# Altium project 3DAS_4Camera.PrjPcb (part 4 of 10)

## Sheet [8] RJ45 Connector.SchDoc: ARS Camera REV01 USB and WiFi
size A4; DrawnBy: Manh Ngo Van; Engineer: Manh Ngo Van; Organization: Altium Limited; Address1: L3, 12a Rodborough Rd; Address2: Frenchs Forest; Address3: NSW; Address4: Australia 2086; DocumentNumber: 8; Revision: 1.0; SheetNumber: 8; SheetTotal: 16
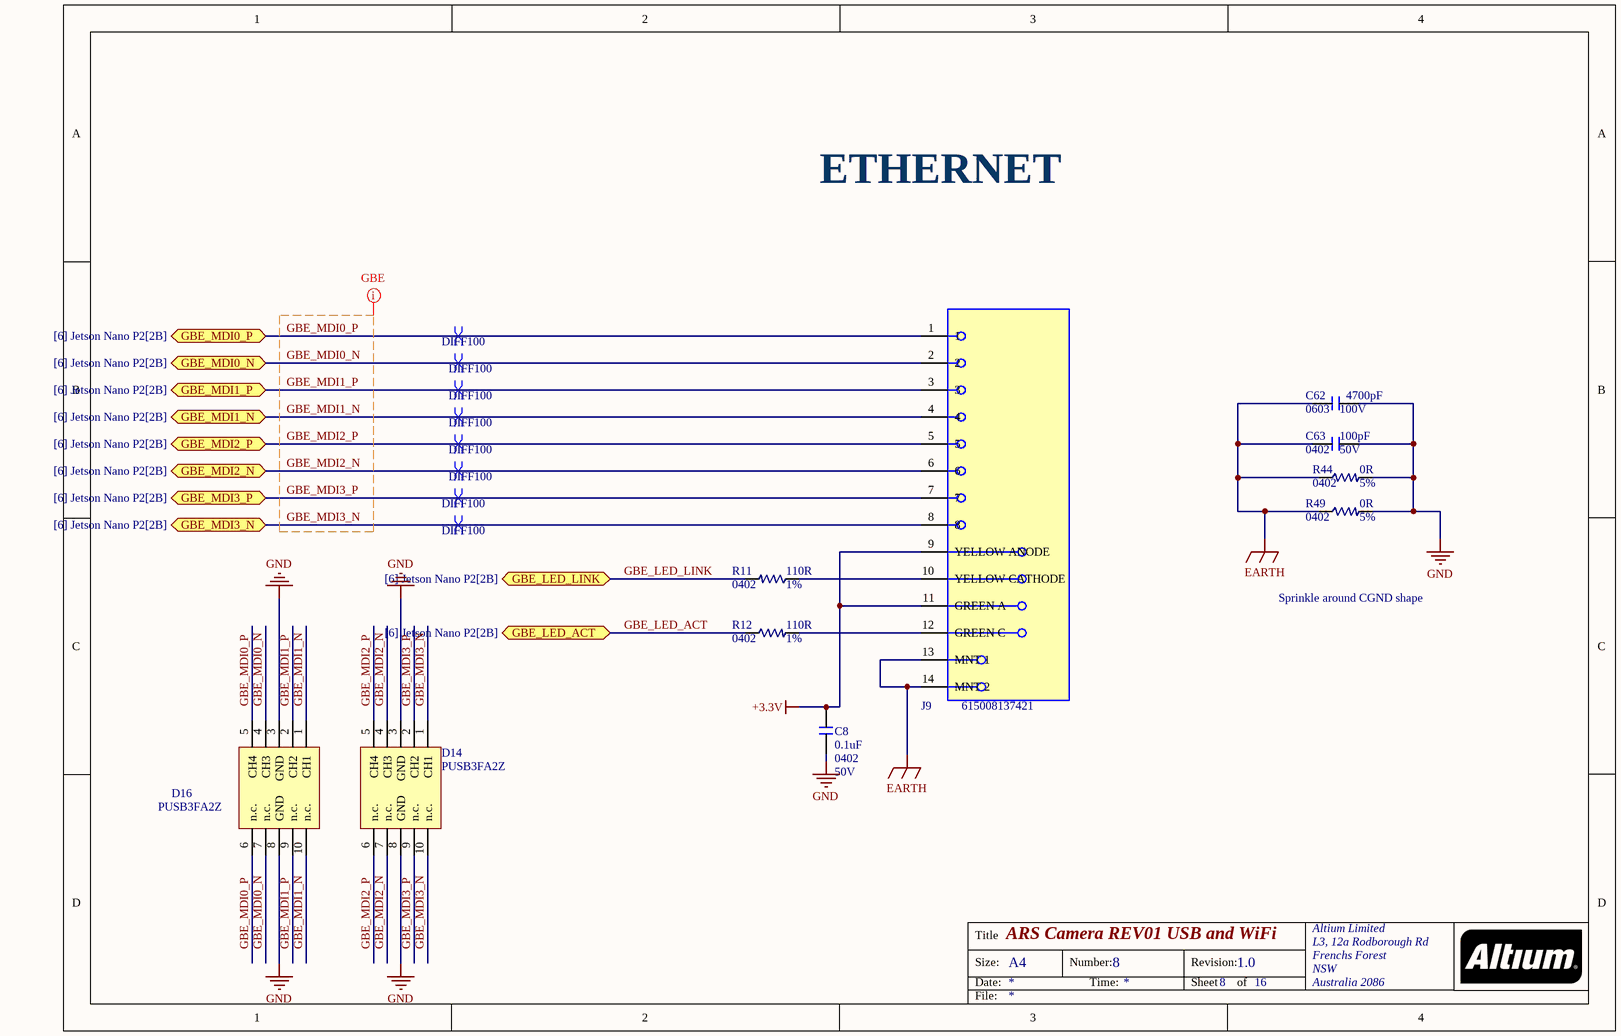
[diagram p7: [8] RJ45 Connector.SchDoc]

### Parts
C8  0.1uF  Case/Package: 0402  Voltage: 50V  [C0402M]
C62  4700pF  Case/Package: 0603  Voltage Rating: 100V  [C0603M]
C63  100pF  Case/Package: 0402  Voltage: 50V  [C0402M]
D14  PUSB3FA2Z  [SON50P100X50-10N]
D16  PUSB3FA2Z  [SON50P100X50-10N]
J9  615008137421  [Wurth_615008137421_MFG]
R11  110R  Case Code (Imperial): 0402  Tolerance: 1%  [R0402M]
R12  110R  Case Code (Imperial): 0402  Tolerance: 1%  [R0402M]
R44  0R  Case/Package: 0402  Resistance Tolerance: 5%  [R0402M]
R49  0R  Case/Package: 0402  Resistance Tolerance: 5%  [R0402M]

### Ports
GBE_LED_ACT (bidir, see [6] Jetson Nano P2[2B]), GBE_LED_LINK (bidir, see [6] Jetson Nano P2[2B]), GBE_MDI0_N (bidir, see [6] Jetson Nano P2[2B]), GBE_MDI0_P (bidir, see [6] Jetson Nano P2[2B]), GBE_MDI1_N (bidir, see [6] Jetson Nano P2[2B]), GBE_MDI1_P (bidir, see [6] Jetson Nano P2[2B]), GBE_MDI2_N (bidir, see [6] Jetson Nano P2[2B]), GBE_MDI2_P (bidir, see [6] Jetson Nano P2[2B]), GBE_MDI3_N (bidir, see [6] Jetson Nano P2[2B]), GBE_MDI3_P (bidir, see [6] Jetson Nano P2[2B])

### Nets
+3.3V: C8.2 J9.9(YELLOW_ANODE) J9.11(GREEN_A)
EARTH: C62.1 C63.2 J9.13(MNT_1) J9.14(MNT_2) R44.2 R49.2
GND: C8.1 C62.2 C63.1 D14.3(GND) D14.8(GND) D16.3(GND) D16.8(GND) R44.1 R49.1
GBE_LED_ACT: R12.2 ; port GBE_LED_ACT
GBE_LED_LINK: R11.1 ; port GBE_LED_LINK
GBE_MDI0_N: D16.4(CH3) D16.7(n.c.) J9.2 ; port GBE_MDI0_N
GBE_MDI0_P: D16.5(CH4) D16.6(n.c.) J9.1 ; port GBE_MDI0_P
GBE_MDI1_N: D16.1(CH1) D16.10(n.c.) J9.4 ; port GBE_MDI1_N
GBE_MDI1_P: D16.2(CH2) D16.9(n.c.) J9.3 ; port GBE_MDI1_P
GBE_MDI2_N: D14.4(CH3) D14.7(n.c.) J9.6 ; port GBE_MDI2_N
GBE_MDI2_P: D14.5(CH4) D14.6(n.c.) J9.5 ; port GBE_MDI2_P
GBE_MDI3_N: D14.1(CH1) D14.10(n.c.) J9.8 ; port GBE_MDI3_N
GBE_MDI3_P: D14.2(CH2) D14.9(n.c.) J9.7 ; port GBE_MDI3_P
NetJ9_10: J9.10(YELLOW_CATHODE) R11.2
NetJ9_12: J9.12(GREEN_C) R12.1

### Layout directives
differential pair; differential pair class DIFF100; net class DIFF100: GBE_MDI0_N, GBE_MDI0_P, GBE_MDI1_N, GBE_MDI1_P, GBE_MDI2_N, GBE_MDI2_P, GBE_MDI3_N, GBE_MDI3_P
net class GBE; rule Matched Net Lengths [Tolerance = 20mil]: GBE_MDI0_N, GBE_MDI0_P, GBE_MDI1_N, GBE_MDI1_P, GBE_MDI2_N, GBE_MDI2_P, GBE_MDI3_N, GBE_MDI3_P

### Notes on the sheet
- ETHERNET
- Sprinkle around CGND shape
- Title
- Size:
- Date:
- A4
- Number:
- Time:
- Revision:
- Sheet
- of
- File:

### Library data of the parts
C8 = CAP_CER: CAP CER 0.1UF 50V X7R 0402; Manufacturer: Murata; Manufacturer Part Number: GRM155R71H104KE14D; Material: Ceramic; Tolerance: 10%; Capacitance: 100nF; Dissipation Factor: 0.025%; ComponentLink1URL: https://datasheet.ciiva.com/25741/cl10b104kb8nnnl-25741341.pdf?src-supplier=Digi-Key; ComponentLink1Description: https://datasheet.ciiva.com/25741/cl10b104kb8nnnl-25741341.pdf?src-supplier=Digi-Key; ComponentLink2URL: https://datasheet.ciiva.com/26838/getdatasheetpartid-357523-26838415.pdf?src-supplier=Verical; ComponentLink2Description: https://datasheet.ciiva.com/26838/getdatasheetpartid-357523-26838415.pdf?src-supplier=Verical; Supplier 1: Digi-Key; Supplier Part Number 1: 490-10700-1-ND; Stock 1: 2282266; Pricing 1: 1 = 0.10000, 10 = 0.04600, 100 = 0.02050, 500 = 0.01464, 1000 = 0.01150, 2500 = 0.01045, 5000 = 0.00961 (USD); RoHS: Yes; Mount: Surface Mount; Weight: 0.000212oz; Case Code (Metric): 1005; Case Code (Imperial): 0402; Dielectric Material: Ceramic; Min Operating Temperature: -55°C; Max Operating Temperature: 125°C; Packaging: Tape and Reel; Dielectric: X7R; Voltage Rating: 50V; Termination: SMD/SMT; Composition: Ceramic; Voltage Rating (DC): 50V; Package Quantity: 10000; Length: 1mm; Height: 0.5mm; Width: 0.5mm; Thickness: 0.022inch; Depth: 0.5mm; REACH SVHC: No SVHC; Lead Free: Lead Free; ComponentLink3URL: http://www.farnell.com/datasheets/2079156.pdf?src-supplier=Farnell; ComponentLink3Description: http://www.farnell.com/datasheets/2079156.pdf?src-supplier=Farnell; ComponentLink4URL: http://www.mouser.com/ds/2/281/c02e-2905.pdf?src-supplier=Mouser; ComponentLink4Description: http://www.mouser.com/ds/2/281/c02e-2905.pdf?src-supplier=Mouser; ComponentLink5URL: http://components.arrow.com/part/dataview/0323_07030614?src-supplier=Arrow+Europe; ComponentLink5Description: http://components.arrow.com/part/dataview/0323_07030614?src-supplier=Arrow+Europe; ComponentLink6URL: https://search.murata.co.jp/Ceramy/image/img/A01X/G101/ENG/GRM155R71H104KE14-01.pdf?src-supplier=Digi-Key; ComponentLink6Description: https://search.murata.co.jp/Ceramy/image/img/A01X/G101/ENG/GRM155R71H104KE14-01.pdf?src-supplier=Digi-Key; ComponentLink7URL: http://psearch.en.murata.com/capacitor/product/GRM155R71H104KE14%23.pdf?src-supplier=Avnet; ComponentLink7Description: http://psearch.en.murata.com/capacitor/product/GRM155R71H104KE14%23.pdf?src-supplier=Avnet; ComponentLink8URL: http://www.farnell.com/datasheets/2079156.pdf?src-supplier=Element14; ComponentLink8Description: http://www.farnell.com/datasheets/2079156.pdf?src-supplier=Element14; ComponentLink9URL: http://www.farnell.com/datasheets/2079156.pdf?src-supplier=Newark; ComponentLink9Description: http://www.farnell.com/datasheets/2079156.pdf?src-supplier=Newark
C62 = CAP_CER: CAP CER 4700PF 100V X7R 0603; Manufacturer 1: TDK; Manufacturer Part Number 1: CGA3E2X7R2A472K080AA; Mouting Technology: SMT; Capacitance: 4.7nF; Tolerance: 10%; Pin: 2; Supplier 1: Digi-Key; Supplier Part Number 1: 445-5810-1-ND; RoHS: Yes; Category: Ceramic Capacitors; Stock 1: 81816; Pricing 1: 1=0.10000, 10=0.06700, 50=0.03640, 100=0.02960, 500=0.02118, 1000=0.01664 (USD); Mount: Surface Mount; Case Code (Metric): 1608; Case Code (Imperial): 0603; Weight: 7.1E-05oz; Min Operating Temperature: -55°C; Max Operating Temperature: 125°C; Packaging: Tape and Reel; Voltage Rating (DC): 100V; Dielectric: X7R; Termination: SMD/SMT; Series: CGA; Package Quantity: 1; Resistor Type: Ceramic; Length: 1.6mm; Width: 0.031inch; Height: 0.8mm; Depth: 0.8mm; Thickness: 0.035inch; Ratings: AEC-Q200; RoHS Compliant: Yes; REACH SVHC: No SVHC; ComponentLink1URL: https://datasheet.ciiva.com/24218/cga3e2x7r2a472k080aa-266293-24218782.pdf?src-supplier=Mouser; ComponentLink1Description: https://datasheet.ciiva.com/24218/cga3e2x7r2a472k080aa-266293-24218782.pdf?src-supplier=Mouser; ComponentLink2URL: https://datasheet.ciiva.com/7975/1807242-7975353.pdf?src-supplier=Element14; ComponentLink2Description: https://datasheet.ciiva.com/7975/1807242-7975353.pdf?src-supplier=Element14
C63 = CAP_CER: CAP CER 100PF 50V C0G/NP0 0402; Manufacturer: Murata; Manufacturer Part Number: GRM1555C1H101JA01J; Tolerance: 5%; Dielectric: C0G; ComponentLink1URL: https://datasheet.ciiva.com/11786/0900766b80ef921d-11786069.pdf?src-supplier=RSComponents; ComponentLink1Description: https://datasheet.ciiva.com/11786/0900766b80ef921d-11786069.pdf?src-supplier=RSComponents; ComponentLink2URL: https://datasheet.ciiva.com/18184/getdatasheetpartid-199957-18184175.pdf?src-supplier=Verical; ComponentLink2Description: https://datasheet.ciiva.com/18184/getdatasheetpartid-199957-18184175.pdf?src-supplier=Verical; ComponentLink3URL: https://datasheet.ciiva.com/29200/453557-da-01-en-vs-kondensator-0402-29200111.pdf?src-supplier=Conrad; ComponentLink3Description: https://datasheet.ciiva.com/29200/453557-da-01-en-vs-kondensator-0402-29200111.pdf?src-supplier=Conrad; ComponentLink4URL: https://datasheet.ciiva.com/16440/product-16440566.pdf?src-supplier=Future+Electronics; ComponentLink4Description: https://datasheet.ciiva.com/16440/product-16440566.pdf?src-supplier=Future+Electronics; ComponentLink5URL: https://datasheet.ciiva.com/6271/partnumbering-e-01-6271071.pdf?src-supplier=Digi-Key; ComponentLink5Description: https://datasheet.ciiva.com/6271/partnumbering-e-01-6271071.pdf?src-supplier=Digi-Key; ComponentLink6URL: https://datasheet.ciiva.com/29541/partnumbering-e-01-29541637.pdf?src-supplier=Digi-Key; ComponentLink6Description: https://datasheet.ciiva.com/29541/partnumbering-e-01-29541637.pdf?src-supplier=Digi-Key; Supplier 1: Digi-Key; Supplier Part Number 1: 490-7754-1-ND; Stock 1: 869107; Pricing 1: 1 = 0.10000, 10 = 0.03700, 50 = 0.02040, 100 = 0.01660, 500 = 0.01186, 1000 = 0.00932, 2500 = 0.00847, 5000 = 0.00779 (USD); RoHS: Yes; Mount: Surface Mount; Case Code (Imperial): 0402; Case Code (Metric): 1005; Min Operating Temperature: -55°C; Max Operating Temperature: 125°C; Voltage Rating: 50V; Capacitance: 100pF; Voltage Rating (DC): 50V; Packaging: Tape and Reel; Package Quantity: 50000; Termination: SMD/SMT; Length: 1mm; Height: 0.5mm; Width: 0.5mm; Thickness: 0.022inch; Depth: 0.5mm; Radiation Hardening: No; Lead Free: Lead Free; ComponentLink7URL: https://datasheet.ciiva.com/5437/product-5437730.pdf?src-supplier=Mouser; ComponentLink7Description: https://datasheet.ciiva.com/5437/product-5437730.pdf?src-supplier=Mouser; ComponentLink8URL: https://datasheet.ciiva.com/29534/partnumbering-e-01-29534039.pdf?src-supplier=Digi-Key; ComponentLink8Description: https://datasheet.ciiva.com/29534/partnumbering-e-01-29534039.pdf?src-supplier=Digi-Key; ComponentLink9URL: https://datasheet.ciiva.com/11605/product-11605752.pdf?src-supplier=Avnet; ComponentLink9Description: https://datasheet.ciiva.com/11605/product-11605752.pdf?src-supplier=Avnet; ComponentLink10URL: https://datasheet.ciiva.com/29534/partnumbering-e-01-29534040.pdf?src-supplier=Digi-Key; ComponentLink10Description: https://datasheet.ciiva.com/29534/partnumbering-e-01-29534040.pdf?src-supplier=Digi-Key; ComponentLink11URL: https://datasheet.ciiva.com/29534/partnumbering-e-01-29534041.pdf?src-supplier=Digi-Key; ComponentLink11Description: https://datasheet.ciiva.com/29534/partnumbering-e-01-29534041.pdf?src-supplier=Digi-Key
D14 D16 = PUSB3FA2Z: ESD Suppressors / TVS Diodes PUSB3FA2 XSON10; Manufacturer 1: Nexperia; Supplier 1: Digi-Key; Manufacturer Part Number 1: PUSB3FA2Z; RoHS: No; Stock 1: 355; Pricing 1: 1=0.33000, 10=0.25600, 100=0.15390, 500=0.14250, 1000=0.09690, 2000=0.08921 (USD); ComponentLink1URL: https://assets.nexperia.com/documents/data-sheet/PUSB3FA2.pdf?src-supplier=Digi-Key; ComponentLink1Description: https://assets.nexperia.com/documents/data-sheet/PUSB3FA2.pdf?src-supplier=Digi-Key; Supplier Part Number 1: 1727-7813-1-ND
J9 = 615008137421: Modular Jack WR-MJ, Tab Up, Shielded, with LED and EMI Panel Finger, Horizontal Entry, THT, 8P8C; Manufacturer 1: Wurth Electronics; Connector Type: Jack,RJ45; Number of Positions: 8; Number of Ports: 1; Current Rating: 1.5A; Mating Cycles: 500; Gender: Female; Voltage Rating (AC): 120V; Insulation Resistance: 500MR; Supplier 1: RSComponents; Supplier Part Number 1: 7350298; Manufacturer Part Number 1: 615008137421; Stock 1: 919; Pricing 1: 1=2.93900, 15=2.64400, 50=2.44300, 250=2.13400 (USD); RoHS: Yes; Mount: Through Hole,PCB; Contact Plating: Gold,Tin; Contact Material: Copper Alloy; Housing Material: PBT; Color: Black,Green,Yellow; Min Operating Temperature: -40°C; Max Operating Temperature: 85°C; Shielding: Shielded; Packaging: Tray; Package Quantity: 60; Number of Rows: 1; Termination: Through Hole; Direction: Up; Number of Contacts: 8; Orientation: Right Angle; Series: WR-MJ; Length: 13.46mm; Width: 16.25mm; Height: 16.93mm; Depth: 15.75mm; RoHS Compliant: Yes; REACH SVHC: Unknown; Flammability Rating: UL94 V-0; ComponentLink1URL: https://datasheet.ciiva.com/6913/76606-6913951.pdf?src-supplier=Newark; ComponentLink1Description: https://datasheet.ciiva.com/6913/76606-6913951.pdf?src-supplier=Newark; ComponentLink2URL: https://datasheet.ciiva.com/4561/615008137421-71402-4561624.pdf?src-supplier=Mouser; ComponentLink2Description: https://datasheet.ciiva.com/4561/615008137421-71402-4561624.pdf?src-supplier=Mouser; ComponentLink3URL: https://datasheet.ciiva.com/686/615008137421-686729.pdf?src-supplier=Digi-Key; ComponentLink3Description: https://datasheet.ciiva.com/686/615008137421-686729.pdf?src-supplier=Digi-Key; ComponentLink4URL: https://datasheet.ciiva.com/11726/0900766b80f88673-11726176.pdf?src-supplier=RSComponents; ComponentLink4Description: https://datasheet.ciiva.com/11726/0900766b80f88673-11726176.pdf?src-supplier=RSComponents; ComponentLink5URL: https://datasheet.ciiva.com/48689/001088215-da-01-en-wr-com-modular-jack-615008137421-48689541.pdf?src-supplier=Conrad; ComponentLink5Description: https://datasheet.ciiva.com/48689/001088215-da-01-en-wr-com-modular-jack-615008137421-48689541.pdf?src-supplier=Conrad
R11 R12 = RES_SMD: RES SMD 110 OHM 1% 1/16W 0402; Manufacturer 1: Yageo; Manufacturer Part Number 1: RC0402FR-07110RL; Mouting Technology: SMT; Power Rating: 63mW; Voltage Rating: 50V; Temperature Coefficient: 100ppm/°C; Pin: 2; Supplier 1: Digi-Key; Supplier Part Number 1: 311-110LRCT-ND; RoHS: Yes; Category: Chip SMD Resistors; Stock 1: 182858; Pricing 1: 1=0.10000, 10=0.01600, 100=0.00660, 1000=0.00299, 2500=0.00259, 5000=0.00214 (USD); Case/Package: 0402; Number of Pins: 2; Case Code (Metric): 1005; Weight: 2.3E-05oz; Size Code: 0402; Min Operating Temperature: -55°C; Max Operating Temperature: 155°C; Resistance: 110R; Packaging: Tape and Reel; Resistor Type: Thick Film; Termination: SMD/SMT; Voltage Rating (DC): 50V; Features: Moisture Resistant; Series: RC; Max Power Dissipation: 63mW; Number of Terminations: 2; Resistance Tolerance: 1%; Construction: Rectangular; Length: 1mm; Width: 0.5mm; Height: 0.35mm; Depth: 0.5mm; REACH SVHC: No SVHC; Military Standard: Not; Lead Free: Lead Free; RoHS Compliant: Yes; ComponentLink1URL: https://datasheet.ciiva.com/12577/pyu-rc0402-51-rohs-l-6-r-12577287.pdf?src-supplier=Mouser; ComponentLink1Description: https://datasheet.ciiva.com/12577/pyu-rc0402-51-rohs-l-6-r-12577287.pdf?src-supplier=Mouser; ComponentLink2URL: https://datasheet.ciiva.com/17070/pyu-rc0402-51-rohs-l-6-r-17070361.pdf?src-supplier=Future+Electronics; ComponentLink2Description: https://datasheet.ciiva.com/17070/pyu-rc0402-51-rohs-l-6-r-17070361.pdf?src-supplier=Future+Electronics; ComponentLink3URL: https://datasheet.ciiva.com/15189/getdatasheetpartid-325087-15189341.pdf?src-supplier=Verical; ComponentLink3Description: https://datasheet.ciiva.com/15189/getdatasheetpartid-325087-15189341.pdf?src-supplier=Verical; ComponentLink4URL: https://datasheet.ciiva.com/7849/1018594-7849822.pdf?src-supplier=Element14; ComponentLink4Description: https://datasheet.ciiva.com/7849/1018594-7849822.pdf?src-supplier=Element14; ComponentLink5URL: https://datasheet.ciiva.com/7849/1018594-7849823.pdf?src-supplier=Element14; ComponentLink5Description: https://datasheet.ciiva.com/7849/1018594-7849823.pdf?src-supplier=Element14
R44 R49 = RES_SMD: YAGEO - RC0402JR-070RL. - RES, THICK FILM, 0R, 0.0625W, 0402; Mouting Technology: SMT; Resistance: 0mR; Power Rating: 62.5mW; Max Power Dissipation: 63mW; Voltage Rating: 50V; Temperature Coefficient: 200ppm/°C; Pin: 2; Supplier 1: RSComponents; Supplier Part Number 1: 6185804; Manufacturer 1: Yageo; Manufacturer Part Number 1: RC0402JR-070RL; Stock 1: 3830000; Pricing 1: 10000=0.00100, 10000=0.00100 (USD); RoHS: Yes; Contact Plating: Tin,Matte; Case Code (Metric): 1005; Case Code (Imperial): 0402; Size Code: 0402; Min Operating Temperature: -55°C; Max Operating Temperature: 155°C; Resistor Type: Thick Film; Packaging: Tape and Reel; Tolerance: 5%; Number of Terminations: 2; Features: Moisture Resistant; Termination: SMD/SMT; Series: RC; Package Quantity: 1; Technology: THICK FILM; Construction: Rectangular; Length: 1mm; Width: 0.02inch; Height: 0.016inch; Depth: 0.5mm; Radiation Hardening: No; RoHS Compliant: Yes; Lead Free: Lead Free; REACH SVHC: Unknown; Military Standard: Not

## Sheet [9] USB 2.0 .SchDoc: ARS Camera REV01 USB and WiFi
size A4; DrawnBy: Manh Ngo Van; Engineer: Manh Ngo Van; Organization: Altium Limited; Address1: L3, 12a Rodborough Rd; Address2: Frenchs Forest; Address3: NSW; Address4: Australia 2086; DocumentNumber: 9; Revision: 1.0; SheetNumber: 9; SheetTotal: 16
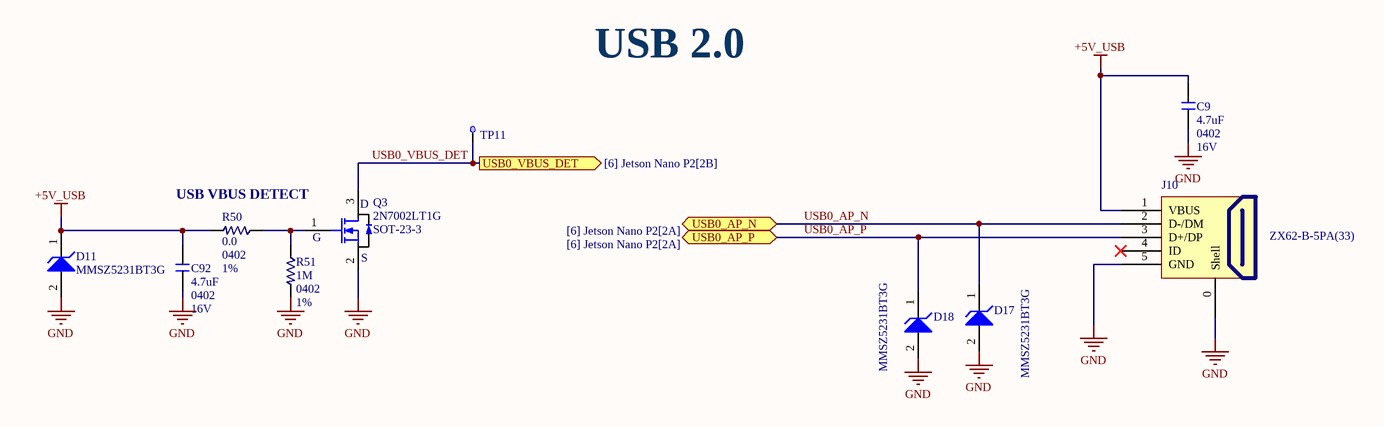
[diagram p8: [9] USB 2.0 .SchDoc]

### Parts
C9  4.7uF  Case/Package: 0402  Voltage Rating: 16V  [C0402M]
C92  4.7uF  Case/Package: 0402  Voltage Rating: 16V  [C0402M]
D11  MMSZ5231BT3G  [SODFL371X135-2N]
D17  MMSZ5231BT3G  [SODFL371X135-2N]
D18  MMSZ5231BT3G  [SODFL371X135-2N]
J10  ZX62-B-5PA(33)  [MICRO-USB-SMD_5P-P0.65-H-M_MICRO-USB-5P]
Q3  2N7002LT1G  Case/Package: SOT-23-3  [SOT95P245X110-3N]
R50  0.0  Case Code (Imperial): 0402  Tolerance: 1%  [R0402M]
R51  1M  Case Code (Imperial): 0402  Tolerance: 1%  [R0402M]
TP11  TP  [Test point]  (value not drawn)  (net tie, no BOM)

### Ports
USB0_AP_N (bidir, see [6] Jetson Nano P2[2A]), USB0_AP_P (bidir, see [6] Jetson Nano P2[2A]), USB0_VBUS_DET (out, see [6] Jetson Nano P2[2B])

### Nets
+5V_USB: C9.1 C92.1 D11.1(K) J10.1(VBUS) R50.1
GND: C9.2 C92.2 D11.2(A) D17.2(A) D18.2(A) J10.0(Shell) J10.5(GND) Q3.2(S) R51.1
USB0_AP_N: D17.1(K) J10.2(D-/DM) ; port USB0_AP_N
USB0_AP_P: D18.1(K) J10.3(D+/DP) ; port USB0_AP_P
USB0_VBUS_DET: Q3.3(D) TP11.1(TP) ; port USB0_VBUS_DET
NetQ3_1: Q3.1(G) R50.2 R51.2

Not connected (* = marked no-connect by the designer): J10 4(ID)*

### Notes on the sheet
- USB 2.0
- (near R50) USB VBUS DETECT
- Title
- Size:
- Date:
- A4
- Number:
- Time:
- Revision:
- Sheet
- of
- File:

### Library data of the parts
C9 C92 = CAP_CER: CAP CER 4.7UF 16V X5R 0402; Manufacturer: Samsung; Manufacturer Part Number: CL05A475MO5NUNC; Tolerance: 20%; ComponentLink1URL: https://datasheet.ciiva.com/25786/cl05a475mp5nrnc-25786963.pdf?src-supplier=Digi-Key; ComponentLink1Description: https://datasheet.ciiva.com/25786/cl05a475mp5nrnc-25786963.pdf?src-supplier=Digi-Key; ComponentLink2URL: https://datasheet.ciiva.com/16437/cl05b104kq5nnnc-16437353.pdf?src-supplier=Future+Electronics; ComponentLink2Description: https://datasheet.ciiva.com/16437/cl05b104kq5nnnc-16437353.pdf?src-supplier=Future+Electronics; Supplier 1: Digi-Key; Supplier Part Number 1: 1276-6836-6-ND; Stock 1: 1677309; Pricing 1: 1 = 0.45000, 10 = 0.32100, 100 = 0.21130, 500 = 0.15656, 1000 = 0.13307, 2500 = 0.12524, 5000 = 0.11741 (USD); RoHS: Yes; Mount: Surface Mount; Case Code (Imperial): 0402; Case Code (Metric): 1005; Min Operating Temperature: -55°C; Max Operating Temperature: 85°C; Packaging: Tape and Reel; Capacitance: 4.7uF; Length: 0.039inch; Width: 0.02inch; Thickness: 0.022inch; ComponentLink3URL: http://www.farnell.com/datasheets/2710653.pdf?src-supplier=Farnell; ComponentLink3Description: http://www.farnell.com/datasheets/2710653.pdf?src-supplier=Farnell; ComponentLink4URL: http://www.farnell.com/datasheets/2710653.pdf?src-supplier=Newark; ComponentLink4Description: http://www.farnell.com/datasheets/2710653.pdf?src-supplier=Newark; ComponentLink5URL: http://www.samsungsem.com/kr/support/product-search/mlcc/CL05A475MO5NUNC.jsp?src-supplier=Digi-Key; ComponentLink5Description: http://www.samsungsem.com/kr/support/product-search/mlcc/CL05A475MO5NUNC.jsp?src-supplier=Digi-Key
D11 D17 D18 = MMSZ5231BT3G: DIODE ZENER 5.1V 500MW SOD123; Manufacturer: ON Semiconductor; Impedance: 17R; Tolerance: 5%; ComponentLink1Description: Manufacturer URL; ComponentLink2Description: Datasheet; ComponentLink3Description: Package Specification; ComponentLink3URL: http://www.onsemi.com/pub_link/Collateral/425-04.PDF; ComponentLink1URL: http://www.onsemi.com/; ComponentLink2URL: http://www.onsemi.com/pub_link/Collateral/MMSZ5221BT1-D.PDF; ComponentLink4URL: https://media.digikey.com/pdf/Data%20Sheets/Ethertronics/M830120.pdf?src-supplier=Digi-Key; ComponentLink4Description: https://media.digikey.com/pdf/Data%20Sheets/Ethertronics/M830120.pdf?src-supplier=Digi-Key; ComponentLink5URL: http://datasheets.avx.com/ethertronics/AVX-E_M830120.pdf?src-supplier=Digi-Key; ComponentLink5Description: http://datasheets.avx.com/ethertronics/AVX-E_M830120.pdf?src-supplier=Digi-Key; Supplier 1: Digi-Key; Supplier Part Number 1: MMSZ5231BT3GOSCT-ND; Manufacturer Part Number: MMSZ5231BT3G; Stock 1: 3780; Pricing 1: 1 = 0.21000, 10 = 0.15000, 100 = 0.08090, 500 = 0.06350, 1000 = 0.04410, 2000 = 0.03653, 5000 = 0.03455 (USD); RoHS: Yes; Case/Package: SOD-123-2; Number of Pins: 2; Min Operating Temperature: -55°C; Max Operating Temperature: 150°C; Packaging: Tape and Reel; Zener Voltage: 5.1V; Max Power Dissipation: 500mW; Lead Free: Lead Free; ComponentLink6URL: http://www.mouser.com/ds/2/308/MMSZ5221BT1-D-85810.pdf?src-supplier=Mouser; ComponentLink6Description: http://www.mouser.com/ds/2/308/MMSZ5221BT1-D-85810.pdf?src-supplier=Mouser; ComponentLink7URL: https://4donline.ihs.com/images/VipMasterIC/IC/ONSM/ONSM-S-A0000726829/ONSM-S-A0000726829-1.pdf?hkey=52A5661711E402568146F3353EA87419&src-supplier=Farnell; ComponentLink7Description: https://4donline.ihs.com/images/VipMasterIC/IC/ONSM/ONSM-S-A0000726829/ONSM-S-A0000726829-1.pdf?hkey=52A5661711E402568146F3353EA87419&src-supplier=Farnell; ComponentLink8URL: http://www.onsemi.com/pub/Collateral/MMSZ5221BT1-D.PDF?src-supplier=Digi-Key; ComponentLink8Description: http://www.onsemi.com/pub/Collateral/MMSZ5221BT1-D.PDF?src-supplier=Digi-Key; ComponentLink9URL: https://4donline.ihs.com/images/VipMasterIC/IC/ONSM/ONSM-S-A0000726829/ONSM-S-A0000726829-1.pdf?hkey=52A5661711E402568146F3353EA87419&src-supplier=Newark; ComponentLink9Description: https://4donline.ihs.com/images/VipMasterIC/IC/ONSM/ONSM-S-A0000726829/ONSM-S-A0000726829-1.pdf?hkey=52A5661711E402568146F3353EA87419&src-supplier=Newark; ComponentLink10URL: http://www.onsemi.com/pub/Collateral/MMSZ5221BT1-D.PDF?src-supplier=Avnet; ComponentLink10Description: http://www.onsemi.com/pub/Collateral/MMSZ5221BT1-D.PDF?src-supplier=Avnet; ComponentLink11URL: http://www.onsemi.com/pub_link/Collateral/MMSZ5221BT1-D.PDF?src-supplier=Digi-Key; ComponentLink11Description: http://www.onsemi.com/pub_link/Collateral/MMSZ5221BT1-D.PDF?src-supplier=Digi-Key
J10 = USB Mini: USB - micro B USB 2.0 Receptacle Connector 5 Position Surface Mount, Right Angle; Manufacturer: Hirose; Number of Contacts: 5; USB Standard: USB 2.0; Current Rating: 1.8A; Mating Cycles: 10000; ComponentLink1URL: https://www.molex.com/pdm_docs/sd/1050170001_sd.pdf; ComponentLink1Description: https://www.molex.com/pdm_docs/sd/1050170001_sd.pdf; Supplier 1: Digi-Key; Supplier Part Number 1: H125270CT-ND; Manufacturer Part Number: ZX62-B-5PA(33); Stock 1: 8359; Pricing 1: 1 = 0.84000, 10 = 0.79200, 25 = 0.71280, 50 = 0.63360, 100 = 0.60720, 250 = 0.55440, 500 = 0.52800, 1000 = 0.43560 (USD); RoHS: Yes; Mount: Surface Mount,Horizontal; Contact Material: Copper Alloy; Contact Plating: Gold; Packaging: Tape and Reel; Connector Type: USB; Gender: Receptacle; Orientation: Right Angle; REACH SVHC: Unknown; Lead Free: Lead Free; ComponentLink2URL: http://www.farnell.com/datasheets/2691174.pdf?src-supplier=Farnell; ComponentLink2Description: http://www.farnell.com/datasheets/2691174.pdf?src-supplier=Farnell; ComponentLink3URL: http://www.farnell.com/datasheets/2691174.pdf?src-supplier=Element14; ComponentLink3Description: http://www.farnell.com/datasheets/2691174.pdf?src-supplier=Element14; ComponentLink4URL: https://www.hirose.com/product/en/download_file/key_name/ZX62-B-5PA%2833%29/category/Specification%20Sheet/doc_file_id/87473/?file_category_id=9&item_id=02420033833&is_series=&src-supplier=Digi-Key; ComponentLink4Description: https://www.hirose.com/product/en/download_file/key_name/ZX62-B-5PA%2833%29/category/Specification%20Sheet/doc_file_id/87473/?file_category_id=9&item_id=02420033833&is_series=&src-supplier=Digi-Key; ComponentLink5URL: http://www.farnell.com/datasheets/2060515.pdf?src-supplier=Element14; ComponentLink5Description: http://www.farnell.com/datasheets/2060515.pdf?src-supplier=Element14; ComponentLink6URL: http://www.farnell.com/datasheets/2691174.pdf?src-supplier=Newark; ComponentLink6Description: http://www.farnell.com/datasheets/2691174.pdf?src-supplier=Newark
Q3 = NMOS: MOSFET N-CH 60V 0.115A SOT-23; Manufacturer: ON Semiconductor; Gate to Source Voltage (Vgs): 20V; Continuous Drain Current (ID): 115mA; Turn-Off Delay Time: 40ns; Turn-On Delay Time: 20ns; Rds On Max: 7.5R; Input Capacitance: 50pF; Nominal Vgs: 2.5V; Number of Elements: 1; Max Power Dissipation: 225mW; Element Configuration: Single; Power Dissipation: 300mW; ComponentLink1URL: https://datasheet.ciiva.com/6371/dmn65d8l-6371124.pdf?src-supplier=Digi-Key; ComponentLink1Description: https://datasheet.ciiva.com/6371/dmn65d8l-6371124.pdf?src-supplier=Digi-Key; ComponentLink2URL: https://datasheet.ciiva.com/13058/dmn65d8l-219098-13058455.pdf?src-supplier=Mouser; ComponentLink2Description: https://datasheet.ciiva.com/13058/dmn65d8l-219098-13058455.pdf?src-supplier=Mouser; ComponentLink3URL: https://datasheet.ciiva.com/6371/dmn65d8l-6371126.pdf?src-supplier=Digi-Key; ComponentLink3Description: https://datasheet.ciiva.com/6371/dmn65d8l-6371126.pdf?src-supplier=Digi-Key; ComponentLink4URL: https://datasheet.ciiva.com/6371/dmn65d8l-6371128.pdf?src-supplier=Digi-Key; ComponentLink4Description: https://datasheet.ciiva.com/6371/dmn65d8l-6371128.pdf?src-supplier=Digi-Key; Supplier 1: Digi-Key; Supplier Part Number 1: 2N7002LT1GOSCT-ND; Manufacturer Part Number: 2N7002LT1G; Stock 1: 616639; Pricing 1: 1 = 0.18000, 10 = 0.16400, 25 = 0.15640, 100 = 0.06880, 250 = 0.06600, 500 = 0.05400, 1000 = 0.03750 (USD); RoHS: Yes; Number of Pins: 3; Contact Plating: Tin,Matte; Min Operating Temperature: -55°C; Max Operating Temperature: 150°C; Package Quantity: 1; On-State Resistance: 7.5R; Packaging: Tape and Reel; Drain to Source Voltage (Vdss): 60V; Drain to Source Breakdown Voltage: 60V; Drain to Source Resistance: 7.5R; Threshold Voltage: 2.5V; Voltage Rating (DC): 60V; Current Rating: 115mA; Number of Channels: 1; Length: 3.04mm; Height: 1.01mm; Width: 1.4mm; Radiation Hardening: No; Lead Free: Lead Free; Halogen Free: Halogen Free; REACH SVHC: No SVHC; ComponentLink5URL: https://datasheet.ciiva.com/936/2n7002l-d-936784.pdf?src-supplier=Digi-Key; ComponentLink5Description: https://datasheet.ciiva.com/936/2n7002l-d-936784.pdf?src-supplier=Digi-Key; ComponentLink6URL: https://datasheet.ciiva.com/22749/1747988-22749570.pdf?src-supplier=Element14; ComponentLink6Description: https://datasheet.ciiva.com/22749/1747988-22749570.pdf?src-supplier=Element14; ComponentLink7URL: https://datasheet.ciiva.com/1188/97418-1188470.pdf?src-supplier=Element14; ComponentLink7Description: https://datasheet.ciiva.com/1188/97418-1188470.pdf?src-supplier=Element14; ComponentLink8URL: https://datasheet.ciiva.com/936/2n7002l-d-936785.pdf?src-supplier=Digi-Key; ComponentLink8Description: https://datasheet.ciiva.com/936/2n7002l-d-936785.pdf?src-supplier=Digi-Key; ComponentLink9URL: https://datasheet.ciiva.com/936/2n7002l-d-936786.pdf?src-supplier=Digi-Key; ComponentLink9Description: https://datasheet.ciiva.com/936/2n7002l-d-936786.pdf?src-supplier=Digi-Key; ComponentLink10URL: https://datasheet.ciiva.com/1254/1747988-1254500.pdf?src-supplier=Newark; ComponentLink10Description: https://datasheet.ciiva.com/1254/1747988-1254500.pdf?src-supplier=Newark; ComponentLink11URL: https://datasheet.ciiva.com/24157/2n7002l-d-24157398.pdf?src-supplier=Future+Electronics; ComponentLink11Description: https://datasheet.ciiva.com/24157/2n7002l-d-24157398.pdf?src-supplier=Future+Electronics; ComponentLink12URL: https://datasheet.ciiva.com/1188/97418-1188471.pdf?src-supplier=Element14; ComponentLink12Description: https://datasheet.ciiva.com/1188/97418-1188471.pdf?src-supplier=Element14; ComponentLink13URL: https://datasheet.ciiva.com/8114/2n7002l-d-8114823.pdf?src-supplier=Avnet; ComponentLink13Description: https://datasheet.ciiva.com/8114/2n7002l-d-8114823.pdf?src-supplier=Avnet; ComponentLink14URL: https://datasheet.ciiva.com/3304/2n7002l-d-3304393.pdf?src-supplier=Avnet; ComponentLink14Description: https://datasheet.ciiva.com/3304/2n7002l-d-3304393.pdf?src-supplier=Avnet; ComponentLink15URL: https://datasheet.ciiva.com/26146/2n7002l-d-26146173.pdf?src-supplier=Avnet+Europe; ComponentLink15Description: https://datasheet.ciiva.com/26146/2n7002l-d-26146173.pdf?src-supplier=Avnet+Europe; ComponentLink16URL: https://datasheet.ciiva.com/16542/2n7002l-d-16542607.pdf?src-supplier=Avnet+Asia; ComponentLink16Description: https://datasheet.ciiva.com/16542/2n7002l-d-16542607.pdf?src-supplier=Avnet+Asia
R50 = RES_SMD: RES SMD 0 OHM JUMPER 1/16W 0402; Manufacturer: Yageo; Manufacturer Part Number: RC0402FR-070RL; Resistance: 0mR; Power Rating: 62.5mW; Voltage Rating: 50V; Temperature Coefficient: 200ppm/°C; Supplier 1: Digi-Key; Supplier Part Number 1: 311-0.0LRCT-ND; Stock 1: 3964331; Pricing 1: 1 = 0.10000, 10 = 0.01200, 25 = 0.00840, 50 = 0.00640, 100 = 0.00470, 250 = 0.00360, 500 = 0.00288, 1000 = 0.00212, 5000 = 0.00152 (USD); RoHS: Yes; Mount: Surface Mount; Case/Package: 0402; Contact Plating: Tin,Matte; Case Code (Metric): 1005; Min Operating Temperature: -55°C; Max Operating Temperature: 155°C; Resistor Type: Thick Film; Packaging: Tape and Reel; Termination: SMD/SMT; Length: 1mm; Width: 0.5mm; Height: 0.35mm; Radiation Hardening: No; Lead Free: Lead Free; ComponentLink1URL: https://datasheet.ciiva.com/8896/pyu-rc0402-51-rohs-l-6-8896149.pdf?src-supplier=Avnet; ComponentLink1Description: https://datasheet.ciiva.com/8896/pyu-rc0402-51-rohs-l-6-8896149.pdf?src-supplier=Avnet; ComponentLink2URL: https://datasheet.ciiva.com/16790/pyu-rc0402-51-rohs-l-6-r-16790444.pdf?src-supplier=Future+Electronics; ComponentLink2Description: https://datasheet.ciiva.com/16790/pyu-rc0402-51-rohs-l-6-r-16790444.pdf?src-supplier=Future+Electronics; ComponentLink3URL: https://datasheet.ciiva.com/28419/pyu-rc0402-51-rohs-l-6-28419661.pdf?src-supplier=Avnet+Europe; ComponentLink3Description: https://datasheet.ciiva.com/28419/pyu-rc0402-51-rohs-l-6-28419661.pdf?src-supplier=Avnet+Europe; ComponentLink4URL: https://datasheet.ciiva.com/16869/pyu-rc0402-51-rohs-l-6-16869518.pdf?src-supplier=Avnet+Europe; ComponentLink4Description: https://datasheet.ciiva.com/16869/pyu-rc0402-51-rohs-l-6-16869518.pdf?src-supplier=Avnet+Europe
R51 = RES_SMD: RES SMD 1M OHM 1% 1/16W 0402; Manufacturer: Yageo; Manufacturer Part Number: RC0402FR-071ML; Resistance: 1MR; Power Rating: 63mW; Voltage Rating: 50V; Temperature Coefficient: 100ppm/°C; Supplier 1: Digi-Key; Supplier Part Number 1: 311-1.00MLRCT-ND; Stock 1: 5211374; Pricing 1: 1 = 0.10000, 10 = 0.01400, 100 = 0.00580, 1000 = 0.00260, 2500 = 0.00226, 5000 = 0.00186 (USD); RoHS: Yes; Case/Package: 0402; Case Code (Metric): 1005; Min Operating Temperature: -55°C; Max Operating Temperature: 155°C; Resistor Type: Thick Film; Packaging: Tape and Reel; Termination: SMD/SMT; Length: 1mm; Height: 0.32mm; Depth: 0.5mm; REACH SVHC: Unknown; Military Standard: Not; Lead Free: Lead Free; ComponentLink1URL: https://datasheet.ciiva.com/11808/0900766b80c66297-11808125.pdf?src-supplier=RSComponents; ComponentLink1Description: https://datasheet.ciiva.com/11808/0900766b80c66297-11808125.pdf?src-supplier=RSComponents; ComponentLink2URL: https://datasheet.ciiva.com/46394/1018594-46394951.pdf?src-supplier=Element14; ComponentLink2Description: https://datasheet.ciiva.com/46394/1018594-46394951.pdf?src-supplier=Element14; ComponentLink3URL: https://datasheet.ciiva.com/16741/pyu-rc0402-51-rohs-l-6-r-16741081.pdf?src-supplier=Future+Electronics; ComponentLink3Description: https://datasheet.ciiva.com/16741/pyu-rc0402-51-rohs-l-6-r-16741081.pdf?src-supplier=Future+Electronics; ComponentLink4URL: https://datasheet.ciiva.com/7849/1018594-7849882.pdf?src-supplier=Element14; ComponentLink4Description: https://datasheet.ciiva.com/7849/1018594-7849882.pdf?src-supplier=Element14; ComponentLink5URL: https://datasheet.ciiva.com/7849/1018594-7849883.pdf?src-supplier=Element14; ComponentLink5Description: https://datasheet.ciiva.com/7849/1018594-7849883.pdf?src-supplier=Element14
TP11 = TestPoint

## Sheet [10] Peripheral.SchDoc: ARS Camera REV01 Peripherals
size A3; DrawnBy: Manh Ngo Van; Engineer: Manh Ngo Van; Organization: Altium Limited; Address1: L3, 12a Rodborough Rd; Address2: Frenchs Forest; Address3: NSW; Address4: Australia 2086; DocumentNumber: 10; Revision: 1.0; SheetNumber: 10; SheetTotal: 16
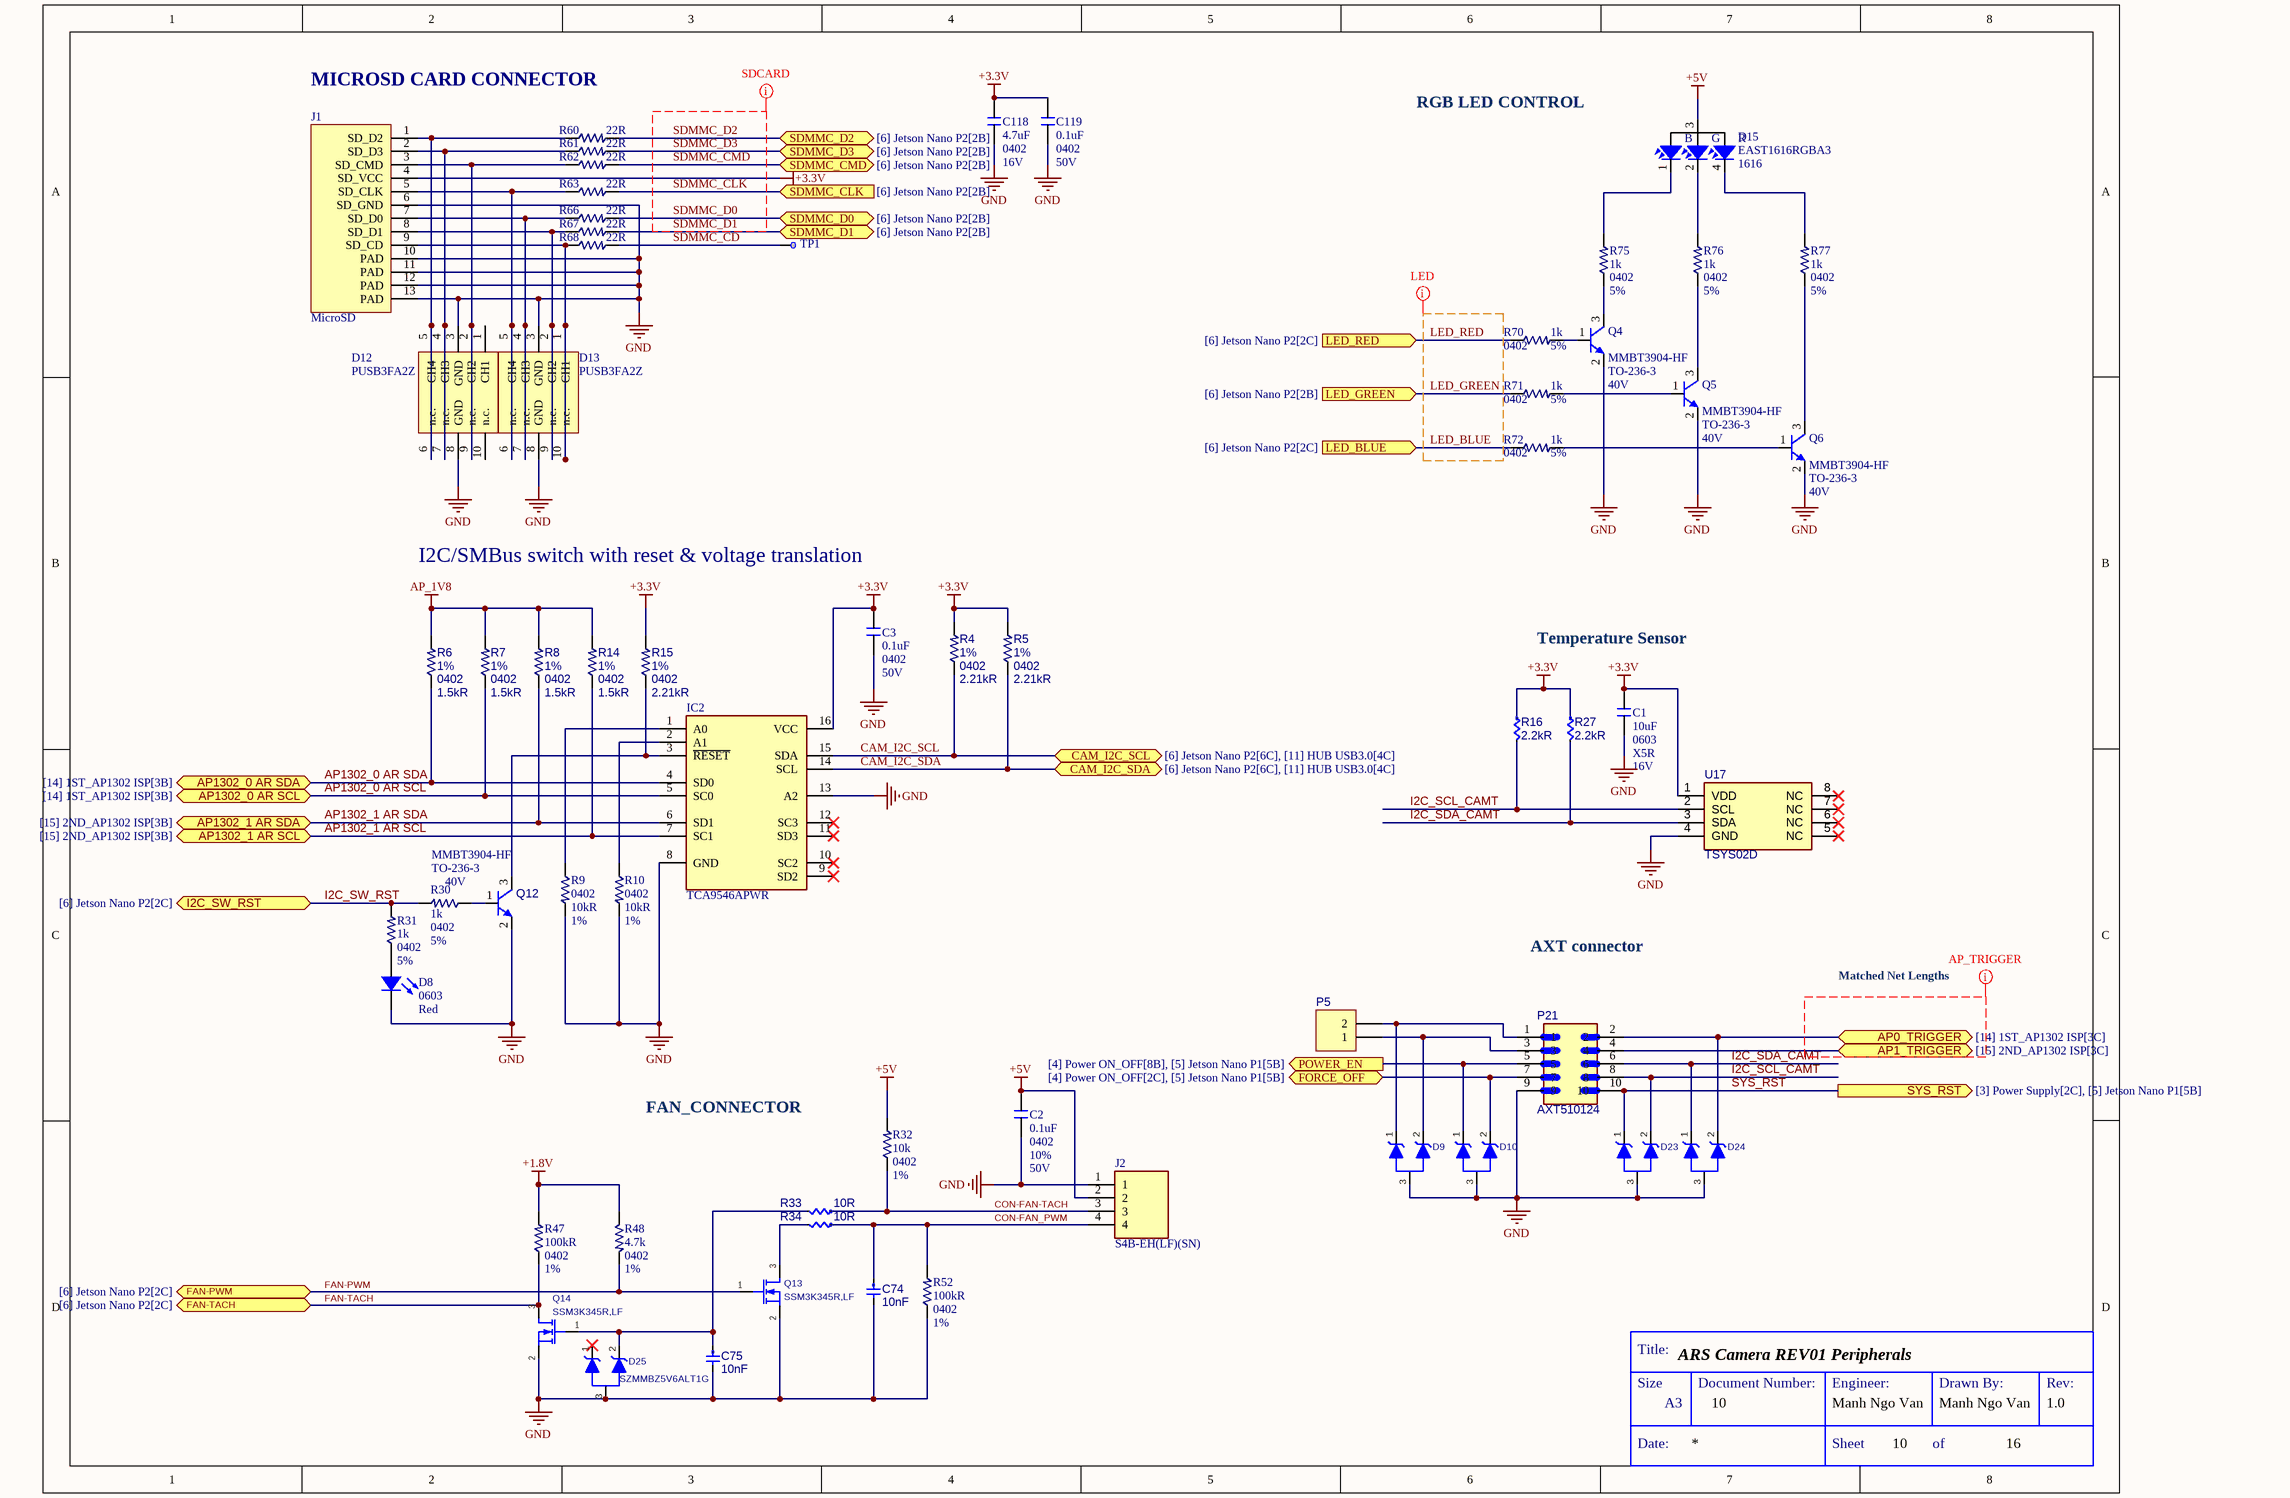
[diagram p9: [10] Peripheral.SchDoc]

### Parts
C1  10uF  Case/Package: 0603  Dielectric: X5R  Voltage Rating (DC): 16V  [C0603M]
C2  0.1uF  Case/Package: 0402  Tolerance: 10%  Voltage: 50V  [C0402M]
C3  0.1uF  Case/Package: 0402  Voltage: 50V  [C0402M]
C74  Capacitance: 10nF  [CAP0402-M]  (hidden comment: 885012205050)
C75  Capacitance: 10nF  [CAP0402-M]  (hidden comment: 885012205050)
C118  4.7uF  Case/Package: 0402  Voltage Rating: 16V  [C0402M]
C119  0.1uF  Case Code (Imperial): 0402  Voltage: 50V  [C0402M]
D8  Case/Package: 0603  Color: Red  [LED-0603]  (hidden comment: LTST-C190CKT)
D9  SZMMBZ5V6ALT1G  [ONSC-SOT-23-3-318-08_V]  (value not drawn)
D10  SZMMBZ5V6ALT1G  [ONSC-SOT-23-3-318-08_V]  (value not drawn)
D12  PUSB3FA2Z  [SON50P100X50-10N]
D13  PUSB3FA2Z  [SON50P100X50-10N]
D15  EAST1616RGBA3  Case Code (Metric): 1616  [EAST1616RGBA3]
D23  SZMMBZ5V6ALT1G  [ONSC-SOT-23-3-318-08_V]  (value not drawn)
D24  SZMMBZ5V6ALT1G  [ONSC-SOT-23-3-318-08_V]  (value not drawn)
D25  SZMMBZ5V6ALT1G  [ONSC-SOT-23-3-318-08_V]
IC2  TCA9546APWR  [TCA9546APWR]
J1  MicroSD  [TF_V3]
J2  S4B-EH(LF)(SN)  [S4B-EH(LF)(SN)_1]
P5  61300211021  [HDR1X2]  (value not drawn)
P21  AXT510124  [AXT510124]
Q4  Manufacturer Part Number 1: MMBT3904-HF  Case/Package: TO-236-3  Collector Emitter Breakdown Voltage: 40V  [SOT55P160X90-3N]
Q5  Manufacturer Part Number 1: MMBT3904-HF  Case/Package: TO-236-3  Collector Emitter Breakdown Voltage: 40V  [SOT55P160X90-3N]
Q6  Manufacturer Part Number 1: MMBT3904-HF  Case/Package: TO-236-3  Collector Emitter Breakdown Voltage: 40V  [SOT55P160X90-3N]
Q12  Manufacturer Part Number 1: MMBT3904-HF  Case/Package: TO-236-3  Collector Emitter Breakdown Voltage: 40V  [SOT55P160X90-3N]  (hidden comment: NPN)
Q13  SSM3K345R,LF  [SSM3K345R,LF-Footprint-1]
Q14  SSM3K345R,LF  [SSM3K345R,LF-Footprint-1]
R4  Tolerance: 1%  Case Code (Imperial): 0402  Resistance: 2.21kR  [R0402M]  (hidden comment: RMCF0402FT2K21)
R5  Tolerance: 1%  Case Code (Imperial): 0402  Resistance: 2.21kR  [R0402M]  (hidden comment: RMCF0402FT2K21)
R6  Tolerance: 1%  Case/Package: 0402  Resistance: 1.5kR  [R0402M]  (hidden comment: AC0402FR-071K5L)
R7  Tolerance: 1%  Case/Package: 0402  Resistance: 1.5kR  [R0402M]  (hidden comment: AC0402FR-071K5L)
R8  Tolerance: 1%  Case/Package: 0402  Resistance: 1.5kR  [R0402M]  (hidden comment: AC0402FR-071K5L)
R9  Case Code (Imperial): 0402  Resistance: 10kR  Resistance Tolerance: 1%  [R0402M]  (hidden comment: RC0402FR-0710KL)
R10  Case Code (Imperial): 0402  Resistance: 10kR  Resistance Tolerance: 1%  [R0402M]  (hidden comment: RC0402FR-0710KL)
R14  Tolerance: 1%  Case/Package: 0402  Resistance: 1.5kR  [R0402M]  (hidden comment: AC0402FR-071K5L)
R15  Tolerance: 1%  Case Code (Imperial): 0402  Resistance: 2.21kR  [R0402M]  (hidden comment: RMCF0402FT2K21)
R16  Resistance: 2.2kR  [RES0402]  (hidden comment: RC0402FR-072K2L)
R27  Resistance: 2.2kR  [RES0402]  (hidden comment: RC0402FR-072K2L)
R30  1k  Case Code (Imperial): 0402  Tolerance: 5%  [R0402M]
R31  1k  Case Code (Imperial): 0402  Tolerance: 5%  [R0402M]
R32  10k  Case Code (Imperial): 0402  Tolerance: 1%  [R0402M]
R33  Resistance: 10R  [RES0805]  (hidden comment: RNCP0805FTD10R0)
R34  Resistance: 10R  [RES0805]  (hidden comment: RNCP0805FTD10R0)
R47  100kR  Case/Package: 0402  Tolerance: 1%  [R0402M]
R48  4.7k  Case Code (Imperial): 0402  Tolerance: 1%  [R0402M]
R52  100kR  Case/Package: 0402  Tolerance: 1%  [R0402M]
R60  22R  [R0402M]
R61  22R  [R0402M]
R62  22R  [R0402M]
R63  22R  [R0402M]
R66  22R  [R0402M]
R67  22R  [R0402M]
R68  22R  [R0402M]
R70  1k  Case Code (Imperial): 0402  Tolerance: 5%  [R0402M]
R71  1k  Case Code (Imperial): 0402  Tolerance: 5%  [R0402M]
R72  1k  Case Code (Imperial): 0402  Tolerance: 5%  [R0402M]
R75  1k  Case Code (Imperial): 0402  Tolerance: 5%  [R0402M]
R76  1k  Case Code (Imperial): 0402  Tolerance: 5%  [R0402M]
R77  1k  Case Code (Imperial): 0402  Tolerance: 5%  [R0402M]
TP1  TP  [Test point]  (value not drawn)  (net tie, no BOM)
U17  TSYS02D  [TSYS02D]

### Ports
AP0_TRIGGER (bidir, see [14] 1ST_AP1302 ISP[3C]), AP1_TRIGGER (bidir, see [15] 2ND_AP1302 ISP[3C]), AP1302_0 AR SCL (bidir, see [14] 1ST_AP1302 ISP[3B]), AP1302_0 AR SDA (bidir, see [14] 1ST_AP1302 ISP[3B]), AP1302_1 AR SCL (bidir, see [15] 2ND_AP1302 ISP[3B]), AP1302_1 AR SDA (bidir, see [15] 2ND_AP1302 ISP[3B]), CAM_I2C_SCL (bidir, see [6] Jetson Nano P2[6C], [11] HUB USB3.0[4C]), CAM_I2C_SDA (bidir, see [6] Jetson Nano P2[6C], [11] HUB USB3.0[4C]), FAN-PWM (bidir, see [6] Jetson Nano P2[2C]), FAN-TACH (bidir, see [6] Jetson Nano P2[2C]), FORCE_OFF (bidir, see [4] Power ON_OFF[2C], [5] Jetson Nano P1[5B]), I2C_SW_RST (bidir, see [6] Jetson Nano P2[2C]), LED_BLUE (in, see [6] Jetson Nano P2[2C]), LED_GREEN (in, see [6] Jetson Nano P2[2B]), LED_RED (in, see [6] Jetson Nano P2[2C]), POWER_EN (out, see [4] Power ON_OFF[8B], [5] Jetson Nano P1[5B]), SDMMC_CLK (in, see [6] Jetson Nano P2[2B]), SDMMC_CMD (bidir, see [6] Jetson Nano P2[2B]), SDMMC_D0 (bidir, see [6] Jetson Nano P2[2B]), SDMMC_D1 (bidir, see [6] Jetson Nano P2[2B]), SDMMC_D2 (bidir, see [6] Jetson Nano P2[2B]), SDMMC_D3 (bidir, see [6] Jetson Nano P2[2B]), SYS_RST (out, see [3] Power Supply[2C], [5] Jetson Nano P1[5B])

### Nets
+1.8V: R47.1 R48.2
+3.3V: C1.2 C3.1 C118.1 C119.2 IC2.16(VCC) J1.4(SD_VCC) R4.1 R5.1 R15.1 R16.1 R27.1 U17.1(VDD)
+5V: C2.1 D15.3(VDD) J2.2 R32.1
AP_1V8: R6.1 R7.1 R8.1 R14.1
GND: C1.1 C2.2 C3.2 C74.2 C75.2 C118.2 C119.1 D8.2(K) D9.3(A) D10.3(A) D12.3(GND) D12.8(GND) D13.3(GND) D13.8(GND) D23.3(A) D24.3(A) D25.3(A) IC2.8(GND) IC2.13(A2) J1.6(SD_GND) J1.10(PAD) J1.11(PAD) J1.12(PAD) J1.13(PAD) J2.1 P21.9 Q4.2(E) Q5.2(E) Q6.2(E) Q12.2(E) Q13.2(S) Q14.2(S) R9.1 R10.1 R52.2 U17.4(GND)
AP0_TRIGGER: D24.2(K2) P21.2 ; port AP0_TRIGGER
AP1_TRIGGER: P21.4 ; port AP1_TRIGGER
AP1302_0 AR SCL: IC2.5(SC0) R7.2 ; port AP1302_0 AR SCL
AP1302_0 AR SDA: IC2.4(SD0) R6.2 ; port AP1302_0 AR SDA
AP1302_1 AR SCL: IC2.7(SC1) R14.2 ; port AP1302_1 AR SCL
AP1302_1 AR SDA: IC2.6(SD1) R8.2 ; port AP1302_1 AR SDA
CAM_I2C_SCL: IC2.15(SDA) R4.2 ; port CAM_I2C_SCL
CAM_I2C_SDA: IC2.14(SCL) R5.2 ; port CAM_I2C_SDA
CON-FAN-TACH: J2.3 R32.2 R33.1
CON-FAN_PWM: C74.1 J2.4 R34.1 R52.1
FAN-PWM: Q13.1(G) R48.1 ; port FAN-PWM
FAN-TACH: Q14.3(D) R47.2 ; port FAN-TACH
FORCE_OFF: D10.2(K2) P21.7 ; port FORCE_OFF
I2C_SCL_CAMT: D23.2(K2) P21.8 R16.2 U17.2(SCL)
I2C_SDA_CAMT: D24.1(K1) P21.6 R27.2 U17.3(SDA)
I2C_SW_RST: R30.1 R31.1 ; port I2C_SW_RST
LED_BLUE: R72.2 ; port LED_BLUE
LED_GREEN: R71.2 ; port LED_GREEN
LED_RED: R70.2 ; port LED_RED
POWER_EN: D10.1(K1) P21.5 ; port POWER_EN
SDMMC_CD: R68.1 TP1.1(TP)
SDMMC_CLK: R63.1 ; port SDMMC_CLK
SDMMC_CMD: R62.1 ; port SDMMC_CMD
SDMMC_D0: R66.1 ; port SDMMC_D0
SDMMC_D1: R67.1 ; port SDMMC_D1
SDMMC_D2: R60.1 ; port SDMMC_D2
SDMMC_D3: R61.1 ; port SDMMC_D3
SYS_RST: D23.1(K1) P21.10 ; port SYS_RST
NetC75_1: C75.1 D25.2(K2) Q14.1(G) R33.2
NetD8_1: D8.1(A) R31.2
NetD9_1: D9.1(K1) P5.2 P21.1
NetD9_2: D9.2(K2) P5.1 P21.3
NetD12_2: D12.2(CH2) D12.9(n.c.) J1.3(SD_CMD) R62.2
NetD12_4: D12.4(CH3) D12.7(n.c.) J1.2(SD_D3) R61.2
NetD12_5: D12.5(CH4) D12.6(n.c.) J1.1(SD_D2) R60.2
NetD13_1: D13.1(CH1) D13.10(n.c.) J1.9(SD_CD) R68.2
NetD13_2: D13.2(CH2) D13.9(n.c.) J1.8(SD_D1) R67.2
NetD13_4: D13.4(CH3) D13.7(n.c.) J1.7(SD_D0) R66.2
NetD13_5: D13.5(CH4) D13.6(n.c.) J1.5(SD_CLK) R63.2
NetD15_1: D15.1(B) R75.1
NetD15_2: D15.2(G) R76.1
NetD15_4: D15.4(R) R77.1
NetIC2_1: IC2.1(A0) R9.2
NetIC2_2: IC2.2(A1) R10.2
NetIC2_3: IC2.3(~{RESET}) Q12.3(C) R15.2
NetQ4_1: Q4.1(B) R70.1
NetQ4_3: Q4.3(C) R75.2
NetQ5_1: Q5.1(B) R71.1
NetQ5_3: Q5.3(C) R76.2
NetQ6_1: Q6.1(B) R72.1
NetQ6_3: Q6.3(C) R77.2
NetQ12_1: Q12.1(B) R30.2
NetQ13_3: Q13.3(D) R34.2

Not connected (* = marked no-connect by the designer): D12 1(CH1) 10(n.c.); D25 1(K1)*; IC2 9(SD2)* 10(SC2)* 11(SD3)* 12(SC3)*; U17 5(NC)* 6(NC)* 7(NC)* 8(NC)*

### Layout directives
net class SDCARD; rule Matched Net Lengths [Tolerance = 20mil]: SDMMC_CLK, SDMMC_CMD, SDMMC_D0, SDMMC_D1, SDMMC_D2, SDMMC_D3
net class LED: LED_BLUE, LED_GREEN, LED_RED
net class AP_TRIGGER; rule Matched Net Lengths [Tolerance = 10mil]: (no net found under the mark)

### Notes on the sheet
- MICROSD CARD CONNECTOR
- RGB LED CONTROL
- I2C/SMBus switch with reset & voltage translation
- Temperature Sensor
- AXT connector
- Matched Net Lengths
- FAN_CONNECTOR
- Title:
- Size
- Document Number:
- Engineer:
- Drawn By:
- Rev:
- Date:
- A3
- Sheet
- of